# EasyEDA schematic SCH_SMTCOPS V3_2022-11-25.json
TITLE: SMTCOPS V3 double Empreinte MUX I2C + connecteur 14 points; REV: 1.0; Date: 2022-07-11; Sheet: 1/1; Drawn By: Ugomartino; Company: RACER
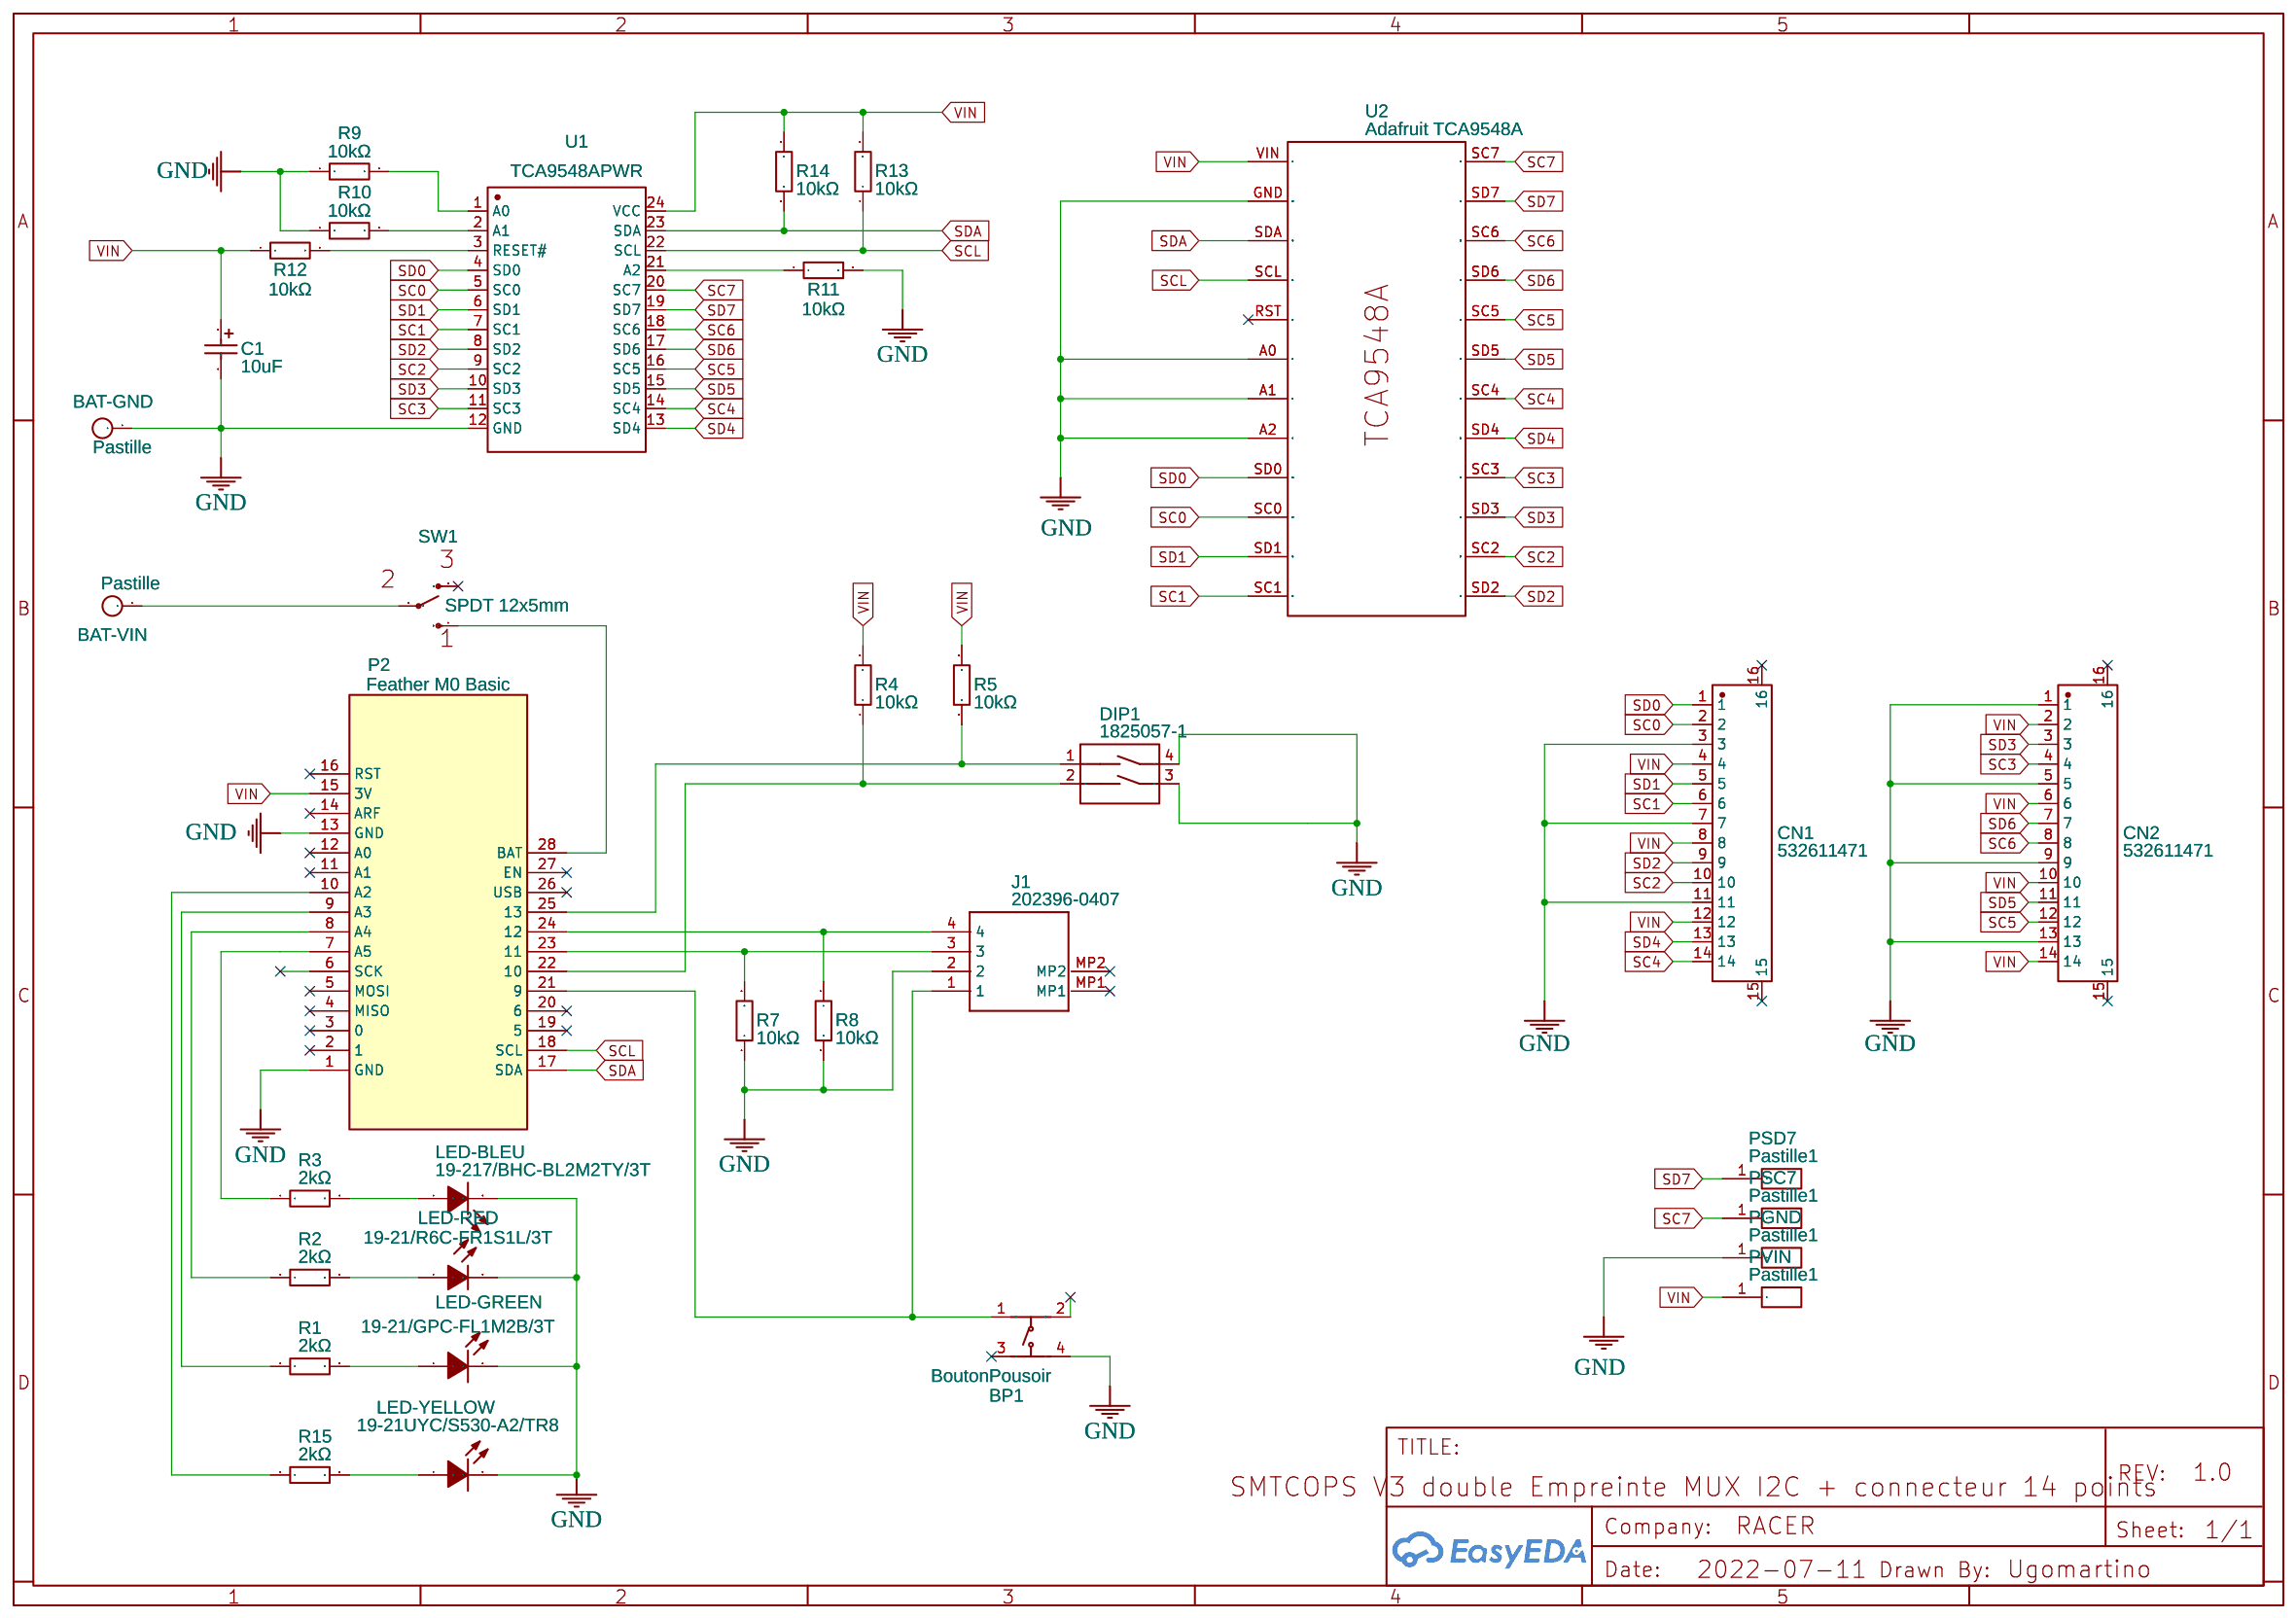
[diagram p0: schematic sheet]

## Parts
BAT-GND  Pastille  [PASTILLE]
BAT-VIN  Pastille  [PASTILLE]
BP1  BoutonPousoir  [KEY-SMD_4P-L6.0-W6.0-P3.90-LS9.0]
C1  10uF  [CAP-SMD_L3.5-W2.8-R-RD]
CN1  532611471  [CONN-SMD_532611471]
CN2  532611471  [CONN-SMD_532611471]
DIP1  1825057-1  [SW-TH_1825057-1]
J1  202396-0407  [2023960407]
LED-BLEU  19-217/BHC-BL2M2TY/3T  [LED0603-R-RD_BLUE]
LED-GREEN  19-21/GPC-FL1M2B/3T  [LED0603-R-RD_GREEN]
LED-RED  19-21/R6C-FR1S1L/3T  [LED0603-R-RD_RED]
LED-YELLOW  19-21UYC/S530-A2/TR8  [LED0603-R-RD_YELLOW]
P2  Feather M0 Basic  [FEATHER M0 BASIC]
PGND  Pastille1  [PASTILLE1]
PSC7  Pastille1  [PASTILLE1]
PSD7  Pastille1  [PASTILLE1]
PVIN  Pastille1  [PASTILLE1]
R1  2kΩ  [R0402]
R2  2kΩ  [R0402]
R3  2kΩ  [R0402]
R4  10kΩ  [R0402]
R5  10kΩ  [R0402]
R7  10kΩ  [R0402]
R8  10kΩ  [R0402]
R9  10kΩ  [R0402]
R10  10kΩ  [R0402]
R11  10kΩ  [R0402]
R12  10kΩ  [R0402]
R13  10kΩ  [R0402]
R14  10kΩ  [R0402]
R15  2kΩ  [R0402]
SW1  SPDT 12x5mm  [SW-TH_EG1206A]
U1  TCA9548APWR  [TSSOP-24_L7.8-W4.4-P0.65-LS6.4-BL]
U2  Adafruit TCA9548A  [TCA9548A]

## Library data of the parts
BAT-GND BAT-VIN = Pastille: Contributor: eviallet
BP1 = TS-1095PS-A3B3-C3D2: Supplier: LCSC; Supplier Part: C2834943; Manufacturer: Yuandi(台湾元迪); Contributor: LCSC; JLCPCB Part Class: Extended Part
C1 = CA45A-B-16V-10UF-K: Supplier: LCSC; Manufacturer: CEC; Supplier Part: C141741; JLCPCB Part Class: Extended Part
CN1 CN2 = 532611471: Supplier: LCSC; Supplier Part: C505101; Manufacturer: MOLEX; Contributor: LCSC; JLCPCB Part Class: Extended Part
DIP1 = 1825057-1: Supplier: LCSC; Manufacturer: TE Connectivity; Supplier Part: C86477; JLCPCB Part Class: Extended Part
J1 = 202396-0407: Contributor: Gowthamsai14
LED-BLEU = 19-217/BHC-BL2M2TY/3T: Supplier: LCSC; Supplier Part: C264471; Manufacturer: Everlight Elec; Contributor: LCSC; JLCPCB Part Class: Extended Part
LED-GREEN = 19-21/GPC-FL1M2B/3T: Supplier: LCSC; Supplier Part: C131241; Manufacturer: Everlight Elec; Contributor: LCSC; JLCPCB Part Class: Extended Part
LED-RED = 19-21/R6C-FR1S1L/3T: Supplier: LCSC; Supplier Part: C183848; Manufacturer: Everlight Elec; Contributor: LCSC; JLCPCB Part Class: Extended Part
LED-YELLOW = 19-21UYC/S530-A2/TR8: Supplier: LCSC; Supplier Part: C90109; Manufacturer: Everlight Elec; Contributor: LCSC; JLCPCB Part Class: Extended Part
P2 = Feather M0 Basic: sourceId: 1T5FDZYC8
PGND PSC7 PSD7 PVIN = Pastille1: Contributor: pirdx
R1-R3 R15 = RMS04FT2001_C208819: Supplier: LCSC; Supplier Part: C208819; Manufacturer: TA-I Tech; Manufacturer Part: RMS04FT2001; Resistance (Ohms): 2K; Contributor: LCSC; JLCPCB Part Class: Extended Part
R4 R5 R7-R14 = TR0402D10KQ1025: Supplier: LCSC; Supplier Part: C149898; Manufacturer: Ever Ohms Tech; Resistance (Ohms): 10K; Contributor: LCSC; JLCPCB Part Class: Extended Part
SW1 = SPDT 12x5mm: Contributor: nematic.business
U1 = TCA9548APWR: Supplier: LCSC; Manufacturer: TI; Supplier Part: C130026; JLCPCB Part Class: Extended Part
U2 = Adafruit TCA9548A: Manufacturer: Adafruit; Manufacturer Part: 2717; Supplier: Digi-Key; Supplier Part: 1528-1363-ND; link: https://www.digikey.com/products/en?keywords=1528-1363-ND; Contributor: JohanEThomsen; Supplier 2: Mouser; Supplier 2 Part: 485-2717

## Nets
GND: BAT-GND.1 BP1.4 C1.2 CN1.3 CN1.7 CN1.11 CN2.1 CN2.5 CN2.9 CN2.13 DIP1.3 DIP1.4 J1.2 LED-BLEU.2(K) LED-GREEN.2(K) LED-RED.2(C) LED-YELLOW.2(K) P2.1(GND) P2.13(GND) PGND.1 R7.1 R8.2 R9.1 R10.1 R11.2 U1.12(GND) U2.A0 U2.A1 U2.A2 U2.GND
VIN: C1.1 CN1.4 CN1.8 CN1.12 CN2.2 CN2.6 CN2.10 CN2.14 P2.15(3V) PVIN.1 R4.2 R5.2 R12.1 R13.2 R14.1 U1.24(VCC) U2.VIN
SC0: CN1.2 U1.5(SC0) U2.SC0
SC1: CN1.6 U1.7(SC1) U2.SC1
SC2: CN1.10 U1.9(SC2) U2.SC2
SC3: CN2.4 U1.11(SC3) U2.SC3
SC4: CN1.14 U1.14(SC4) U2.SC4
SC5: CN2.12 U1.16(SC5) U2.SC5
SC6: CN2.8 U1.18(SC6) U2.SC6
SC7: PSC7.1 U1.20(SC7) U2.SC7
SCL: P2.18(SCL) R13.1 U1.22(SCL) U2.SCL
SD0: CN1.1 U1.4(SD0) U2.SD0
SD1: CN1.5 U1.6(SD1) U2.SD1
SD2: CN1.9 U1.8(SD2) U2.SD2
SD3: CN2.3 U1.10(SD3) U2.SD3
SD4: CN1.13 U1.13(SD4) U2.SD4
SD5: CN2.11 U1.15(SD5) U2.SD5
SD6: CN2.7 U1.17(SD6) U2.SD6
SD7: PSD7.1 U1.19(SD7) U2.SD7
SDA: P2.17(SDA) R14.2 U1.23(SDA) U2.SDA
Net-(BAT-VIN-1): BAT-VIN.1 SW1.2(P)
Net-(BP1-1): BP1.1 J1.1 P2.21(9)
Net-(DIP1-1): DIP1.1 P2.25(13) R5.1
Net-(DIP1-2): DIP1.2 P2.22(10) R4.1
Net-(J1-3): J1.3 P2.23(11) R7.2
Net-(J1-4): J1.4 P2.24(12) R8.1
Net-(LED-BLEU-1): LED-BLEU.1(A) R3.2
Net-(LED-GREEN-1): LED-GREEN.1(A) R1.2
Net-(LED-RED-1): LED-RED.1(A) R2.2
Net-(LED-YELLOW-1): LED-YELLOW.1(A) R15.2
Net-(P2-7): P2.7(A5) R3.1
Net-(P2-8): P2.8(A4) R2.1
Net-(P2-9): P2.9(A3) R1.1
Net-(P2-10): P2.10(A2) R15.1
Net-(P2-28): P2.28(BAT) SW1.1(S)
Net-(R9-2): R9.2 U1.1(A0)
Net-(R10-2): R10.2 U1.2(A1)
Net-(R11-1): R11.1 U1.21(A2)
Net-(R12-2): R12.2 U1.3(RESET#)

Not connected (* = marked no-connect by the designer): BP1 2 3*; CN1 15* 16*; CN2 15* 16*; J1 MP1* MP2*; P2 2(1)* 3(0)* 4(MISO)* 5(MOSI)* 6(SCK) 11(A1)* 12(A0)* 14(ARF)* 16(RST)* 19(5)* 20(6)* 26(USB)* 27(EN)*; SW1 3(O)*; U2 RST*
